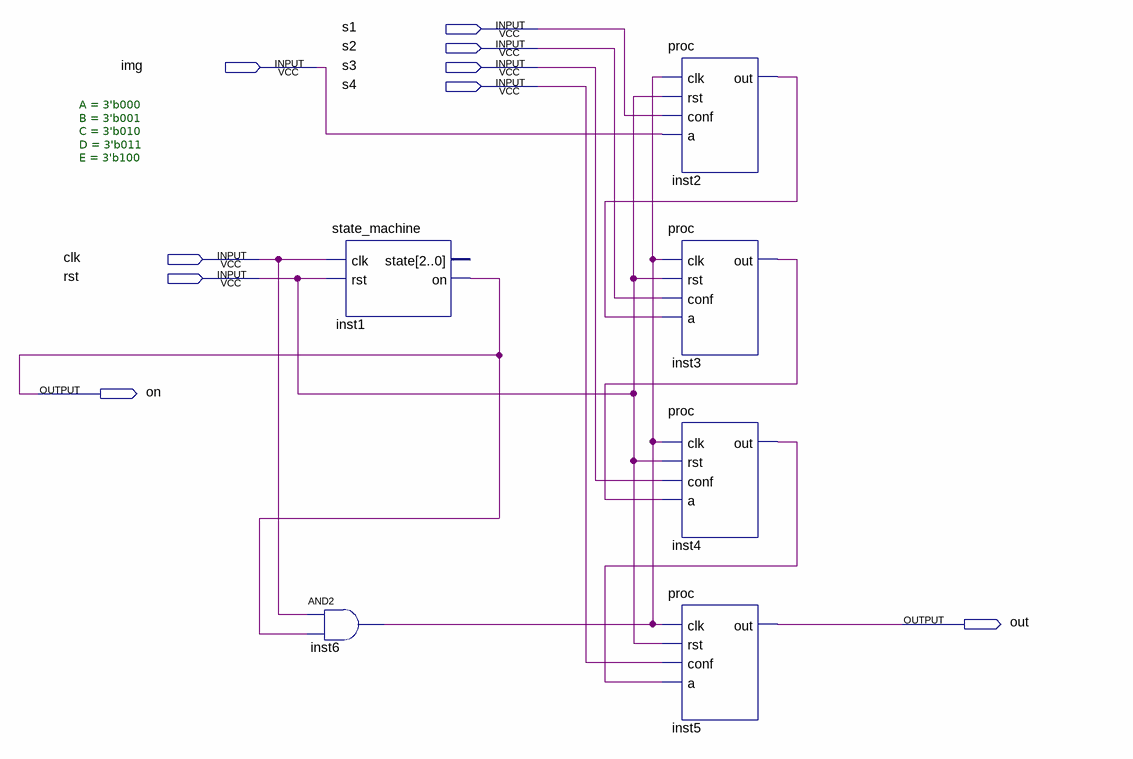
[diagram p0: schematic sheet]
// Quartus schematic maqeproc.bdf as structural Verilog: 6 symbols, 9 pins
module maqeproc (
  input  s1,
  input  s2,
  input  img,
  input  s3,
  input  s4,
  input  clk,
  input  rst,
  output on,
  output out
);

  wire inst2_out, inst3_out, inst4_out, inst6_out;

  state_machine #(.A(3'b000), .B(3'b001), .C(3'b010), .D(3'b011), .E(3'b100)) inst1 (
    .clk(clk), .rst(rst), .on(on));  // open: state
  and inst6 (inst6_out, clk, on);
  proc inst2 (.clk(inst6_out), .rst(rst), .conf(s1), .a(img), .out(inst2_out));
  proc inst3 (.clk(inst6_out), .rst(rst), .conf(s2), .a(inst2_out), .out(inst3_out));
  proc inst4 (.clk(inst6_out), .rst(rst), .conf(s3), .a(inst3_out), .out(inst4_out));
  proc inst5 (.clk(inst6_out), .rst(rst), .conf(s4), .a(inst4_out), .out(out));
endmodule
